# Altium schematic sheet FPGA1.SchDoc
size A4; SheetNumber: 2; SheetTotal: 9
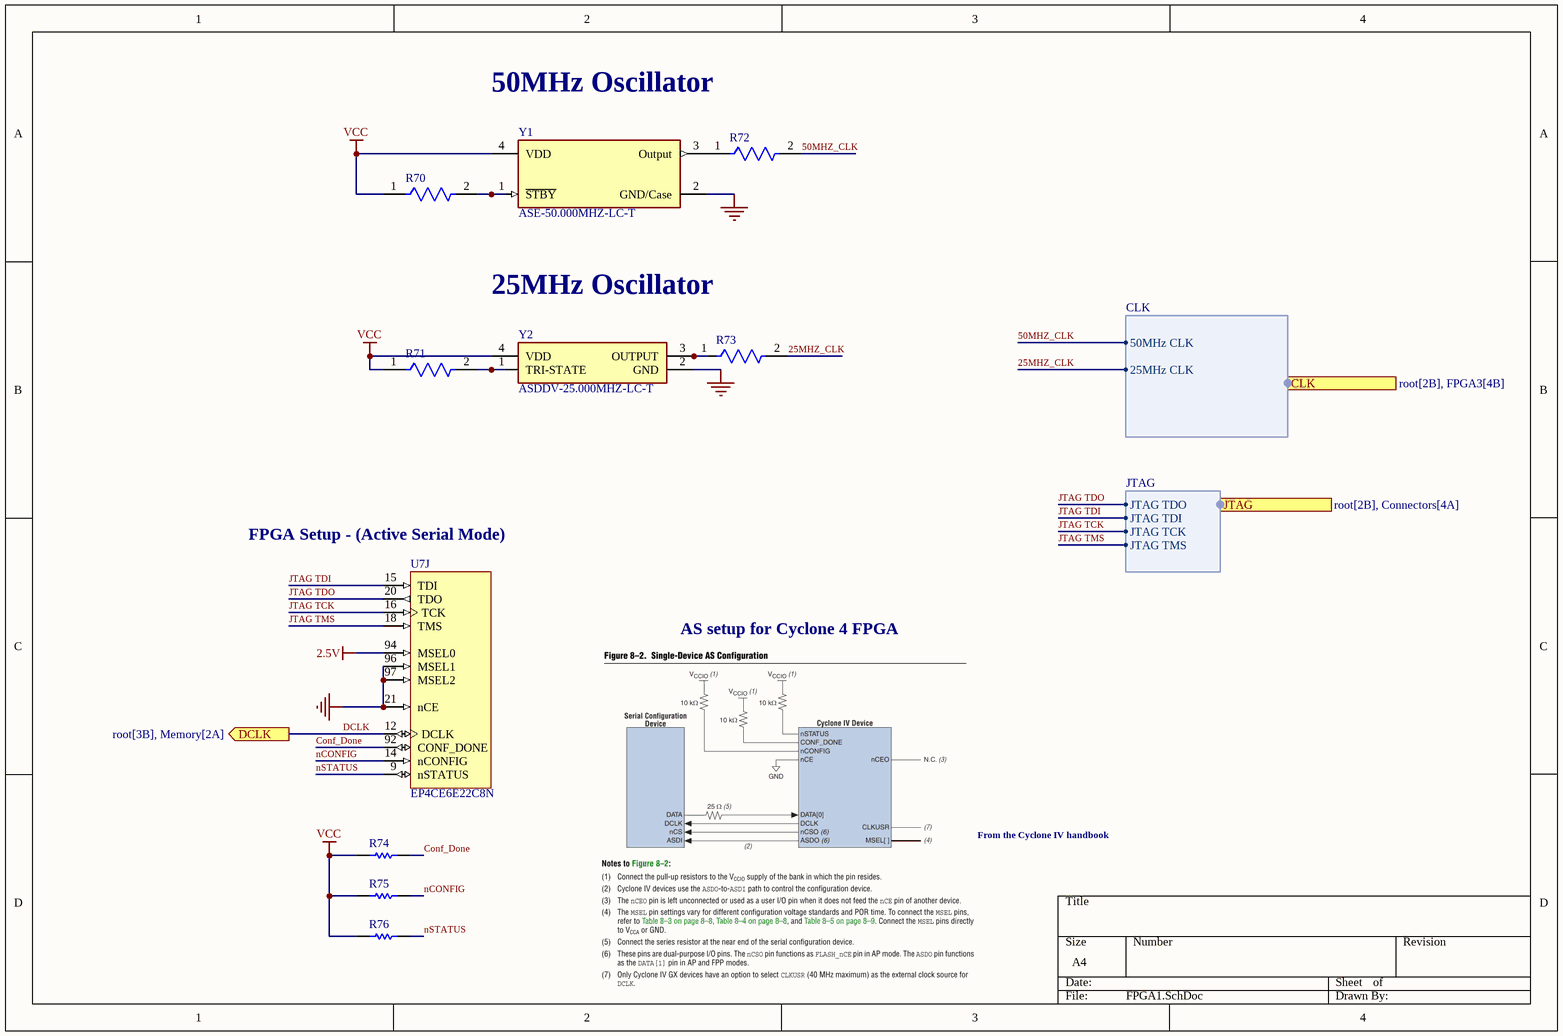
[diagram p0: FPGA1.SchDoc]

## Parts
R70  RC0603FR-073K3L  [FP-RC0603-0_55-MFG]  (value not drawn)
R71  RC0603FR-073K3L  [FP-RC0603-0_55-MFG]  (value not drawn)
R72  RT0402BRE0733RL  [FP-RT0402-MFG]  (value not drawn)
R73  RT0402BRE0733RL  [FP-RT0402-MFG]  (value not drawn)
R74  RC0402FR-0710KL  [RESC1005X40X25LL05T10]  (value not drawn)
R75  RC0402FR-0710KL  [RESC1005X40X25LL05T10]  (value not drawn)
R76  RC0402FR-0710KL  [RESC1005X40X25LL05T10]  (value not drawn)
U7  EP4CE6E22C8N  [EQFP144_A-165_D2-54_M]  (part J of 13)
Y1  ASE-50.000MHZ-LC-T  [FP-ASE-MFG]
Y2  ASDDV-25.000MHZ-LC-T  [AbraconASDDV]

## Ports
CLK (harness CLK, see root[2B], FPGA3[4B]), DCLK (out, see root[3B], Memory[2A]), JTAG (harness JTAG, see root[2B], Connectors[4A])

## Harnesses
CLK: 50MHz CLK, 25MHz CLK
JTAG: JTAG TDO, JTAG TDI, JTAG TCK, JTAG TMS

## Nets
2.5V: U7.94(MSEL0)
GND: U7.21(nCE) U7.96(MSEL1) U7.97(MSEL2) Y1.2(GND/Case) Y2.2(GND)
VCC: R70.1 R71.1 R74.1 R75.1 R76.1 Y1.4(VDD) Y2.4(VDD)
25MHZ_CLK: R73.2 ; port CLK.25MHz CLK
50MHZ_CLK: R72.2 ; port CLK.50MHz CLK
Conf_Done: R74.2 U7.92(CONF_DONE)
DCLK: U7.12(DCLK) ; port DCLK
JTAG TCK: U7.16(TCK) ; port JTAG.JTAG TCK
JTAG TDI: U7.15(TDI) ; port JTAG.JTAG TDI
JTAG TDO: U7.20(TDO) ; port JTAG.JTAG TDO
JTAG TMS: U7.18(TMS) ; port JTAG.JTAG TMS
nCONFIG: R75.2 U7.14(nCONFIG)
nSTATUS: R76.2 U7.9(nSTATUS)
NetR70_2: R70.2 Y1.1(~{STBY})
NetR71_2: R71.2 Y2.1(TRI-STATE)
NetR72_1: R72.1 Y1.3(Output)
NetR73_1: R73.1 Y2.3(OUTPUT)

## Notes on the sheet
- 50MHz Oscillator
- 25MHz Oscillator
- (near U7) FPGA Setup - (Active Serial Mode)
- AS setup for Cyclone 4 FPGA
- From the Cyclone IV handbook

## Library data of the parts
R70 R71 = CMP-1012-00567-3: NexarPartId: 40011875; Tolerance: 1%; Power Rating: 100mW; Temperature Coefficient: 100ppm/°C; Voltage Rating (DC): 50V; Resistance: 3.3kΩ; Military Standard: Not; Case/Package: 0603; Mount: Surface Mount; Lead Free: Lead Free; Packaging: Tape & Reel; Termination: SMD/SMT; Number of Terminations: 2; Composition: Thick Film; Length: 1.6mm; Max Power Dissipation: 100mW; Width: 800µm; Features: Moisture Resistant; Max Operating Temperature: 155°C; Depth: 800µm; Number of Pins: 2; REACH SVHC: No SVHC; Case Code (Imperial): 0603; Case Code (Metric): 0603; RoHS: Compliant; Voltage Rating (AC): 50V; Voltage Rating: 50V; Schedule B: 8533210045, 8533210045; Min Operating Temperature: -55°C; Height: 450µm
R72 R73 = CMP-2002-02979-2: RES SMD 33 OHM 0.1% 1/16W 0402; Manufacturer: Yageo; Power Rating: 0.063W; Temperature Coefficient: 50 ppm/°C; Tolerance: 0.001; Resistance: 33Ω; Value: 33Ω; Voltage Rating: 50V; Lead Free: Yes; Temperature Range Low: -55°C; ComponentLink2Description: Datasheet; Device Class L2: Resistors; Footprint Url: http://www.yageo.com/exep/pages/download/literatures/PYu-R_Mount_10.pdf; Temperature: -55°C to +155°C; Automotive: No; Manufacturer Part Number: RT0402BRE0733RL; Series: RT; Device Class L3: Chip SMD Resistors; Height: 0.35mm; Digikey Description: RES SMD 33 OHM 0.1% 1/16W 0402; Octopart: https://octopart.com/rt0402bre0733rl-yageo-1202878; Package: RT0402; ComponentLink2URL: http://www.yageo.com/documents/recent/PYu-RT_1-to-0.01_RoHS_L_9.pdf; Composition: Thin Film; Category: Res; Ipc Land Pattern Name: RESC10050X30; Device Class L1: Passive Components; RoHS: TRUE; Temperature Range High: +155°C
R74-R76 = CMP-2002-07353-1: Manufacturer: Yageo / Phycomp; Part Number: RC0402FR-0710KL
U7 = CMP-0038-00212-1: Cyclone IV Family FPGA, 1.2V Core, 91 I/O Pins, 2 PLLs, 144-Pin QFP, Speed Grade 8, Commercial Grade, Pb-Free; Manufacturer: Altera; ComponentLink3Description: Pinout; ComponentLink4Description: Package Specification; DatasheetVersion: ver1.6, Nov-2011; ComponentLink1URL: http://www.altera.com/; ComponentLink2URL: http://www.altera.com/literature/hb/cyclone-iv/cyclone4-handbook.pdf; ComponentLink2Description: Handbook; PackageReference: EQFP144_A-165_D2-54; ComponentLink3URL: http://www.altera.com/literature/lit-dp.jsp?category=cyc%204&showspreadsheet=y; PackageVersion: ver1.0, Jan-2011; ComponentLink1Description: Manufacturer URL; ComponentLink4URL: http://www.altera.com/devicepackaging/04R00402-00.pdf; PackageDescription: 144-Pin Plastic Enhanced Quad Flat Pack (EQFP) - Wire Bond - A:1.65 - D2:5.4; Code_JEDEC: MS-026-BFB-HD
Y1 = CMP-27762-009764-1: XTAL Oscillator 50MHz ±50ppm CMOS 3.3V 4-SMD 3.2mm x 2.5mm; Load Capacitance: 15pF; Max Supply Current: 19mA; Min Supply Voltage: 3.135V; Max Supply Voltage: 3.465V; Packaging: Tape and Reel; Height: 0.047inch; Mount: Surface Mount; Frequency Stability: 50ppm; Lead Free: Lead Free; Number of Pins: 4; Width: 0.098inch; Radiation Hardening: No; Max Operating Temperature: 85°C; Length: 3.2mm; REACH SVHC: No SVHC; Series: ASE; Depth: 2.5mm; Operating Supply Voltage: 3.3V; Min Operating Temperature: -40°C; Package Quantity: 1000; Operating Frequency: 50 MHz; Case/Package: SMD/SMT; Termination: SMD/SMT; Frequency: 50MHz
Y2 = ASDDV-25.000MHZ-LC-T: Crystal or Oscillator; Manufacturer_Name: ABRACON; Datasheet Link: https://abracon.com/datasheets/ASDDV.pdf; Height: 0.95mm; Manufacturer_Part_Number: ASDDV-25.000MHZ-LC-T; Mouser Part Number: 815-ASDDV-2500MHZLCT; Mouser Price/Stock: https://www.mouser.co.uk/ProductDetail/ABRACON/ASDDV-25.000MHZ-LC-T?qs=GedFDFLaBXGr7Q4o6E2H1w%3D%3D; Arrow Part Number: ASDDV-25.000MHZ-LC-T; Arrow Price/Stock: https://www.arrow.com/en/products/asddv-25.000mhz-lc-t/abracon?region=nac